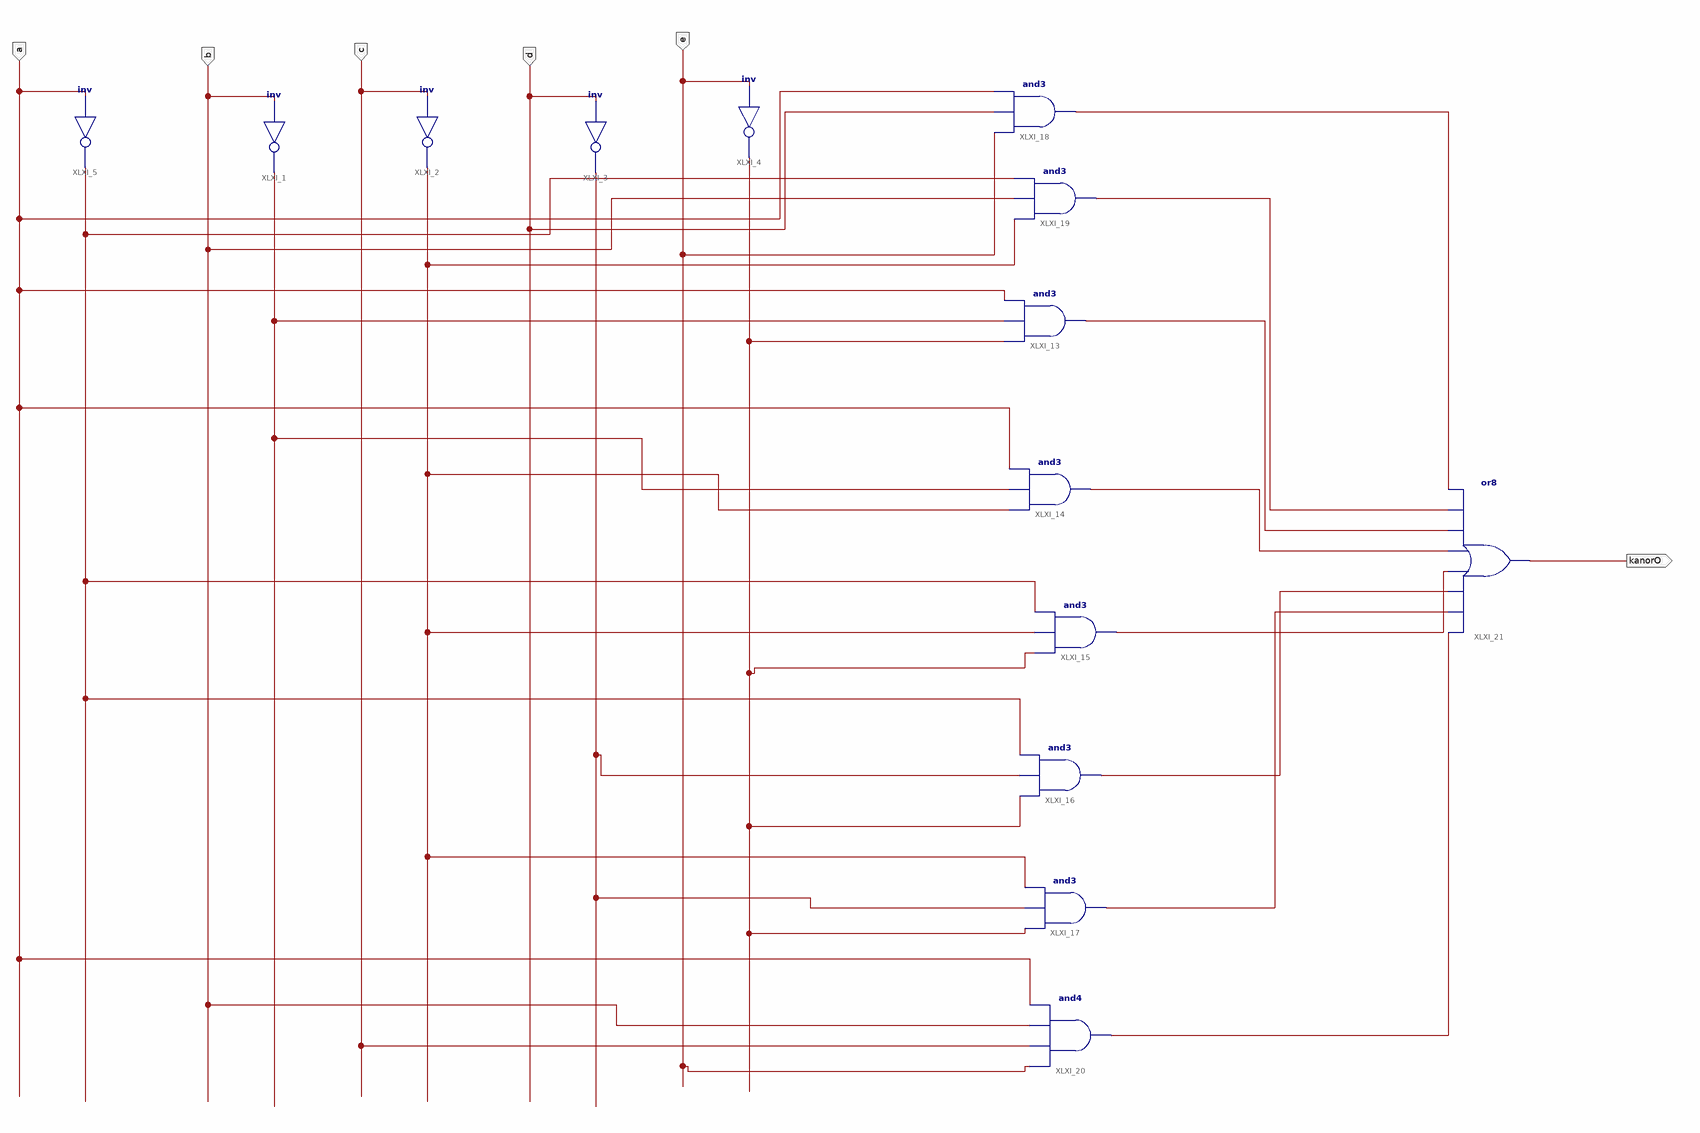
[diagram p0: schematic sheet 1]
// Xilinx ISE schematic kanor.sch (spartan6) as structural Verilog: 14 symbols, 6 ports
module kanor (
  input  a,
  input  b,
  input  c,
  input  d,
  input  e,
  output kanorO
);

  wire XLXN_2, XLXN_25, XLXN_27, XLXN_28, XLXN_29, XLXN_31, XLXN_33, XLXN_41, XLXN_42, XLXN_44, XLXN_45,
       XLXN_47, XLXN_49;

  not XLXI_5 (XLXN_41, a);
  not XLXI_1 (XLXN_2, b);
  not XLXI_2 (XLXN_44, c);
  not XLXI_3 (XLXN_42, d);
  not XLXI_4 (XLXN_45, e);
  and XLXI_13 (XLXN_28, XLXN_45, XLXN_2, a);
  and XLXI_14 (XLXN_29, XLXN_44, XLXN_2, a);
  and XLXI_15 (XLXN_47, XLXN_45, XLXN_44, XLXN_41);
  and XLXI_16 (XLXN_31, XLXN_45, XLXN_42, XLXN_41);
  and XLXI_17 (XLXN_49, XLXN_45, XLXN_42, XLXN_44);
  and XLXI_18 (XLXN_25, e, d, a);
  and XLXI_19 (XLXN_27, XLXN_44, b, XLXN_41);
  and XLXI_20 (XLXN_33, e, c, b, a);
  or XLXI_21 (kanorO, XLXN_33, XLXN_49, XLXN_31, XLXN_47, XLXN_29, XLXN_28, XLXN_27, XLXN_25);
endmodule
